# EAGLE design aircom (EAGLE 6.2)
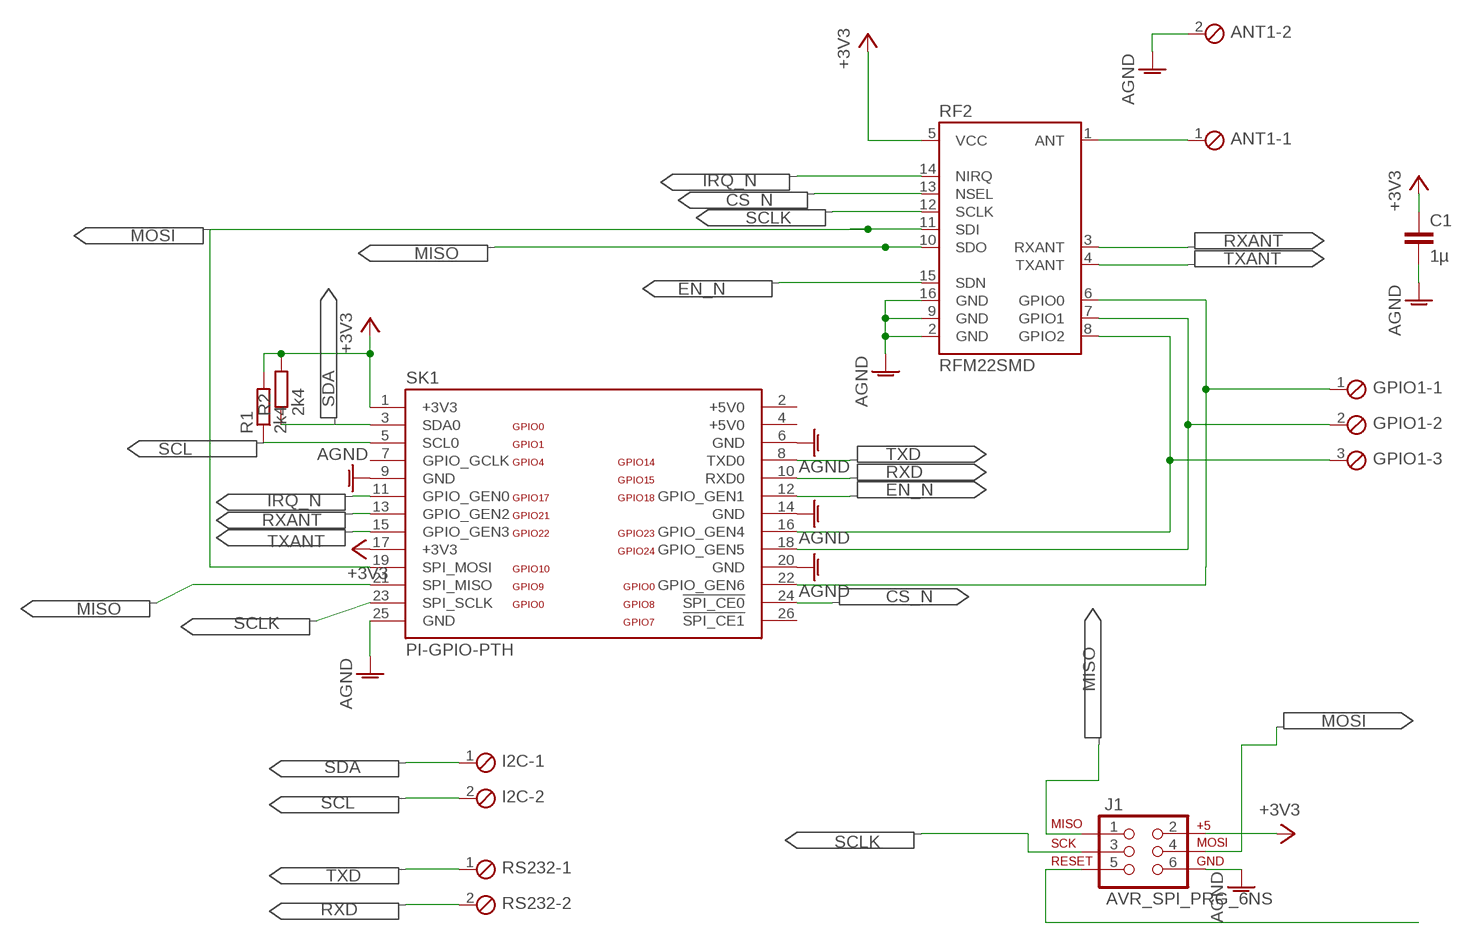
[diagram p0: schematic, sheet 1]

## Parts
ANT1  MPT2  [2POL254]
C1  1µ  C-EUC0805  [C0805]
GPIO1  MPT3  [3POL254]
I2C  MPT2  [2POL254]
J1  AVR_SPI_PRG_6NS  [2X3-NS]
R1  2k4  R-EU_R0603  [R0603]
R2  2k4  R-EU_R0603  [R0603]
RF2  RFM22SMD  [RFM22-XXX-S2]
RS232  MPT2  [2POL254]
SK1  PI-GPIO-PTH  [GPIO-CONNECTOR]

## Nets
+3V3: C1.1 J1.2 R1.2 R2.2 RF2.5(VCC) SK1.1(+3V3) SK1.17(+3V3)
AGND: ANT1.2 C1.2 J1.6 RF2.2(GND) RF2.9(GND) RF2.16(GND) SK1.6(GND) SK1.9(GND) SK1.14(GND) SK1.20(GND) SK1.25(GND)
ANT: ANT1.1 RF2.1(ANT)
CS_N: RF2.13(NSEL) SK1.24(!SPI_CE0)
EN_N: RF2.15(SDN) SK1.12(GPIO_GEN1)
GPIO0: GPIO1.1 RF2.6(GPIO0) SK1.22(GPIO_GEN6)
GPIO1: GPIO1.2 RF2.7(GPIO1) SK1.18(GPIO_GEN5)
GPIO2: GPIO1.3 RF2.8(GPIO2) SK1.16(GPIO_GEN4)
IRQ_N: RF2.14(NIRQ) SK1.11(GPIO_GEN0)
MISO: J1.1 RF2.10(SDO) SK1.21(SPI_MISO)
MOSI: J1.4 RF2.11(SDI) SK1.19(SPI_MOSI)
RESET1: J1.5
RXANT: RF2.3(RXANT) SK1.13(GPIO_GEN2)
RXD: RS232.2 SK1.10(RXD0)
SCL: I2C.2 R1.1 SK1.5(SCL0)
SCLK: J1.3 RF2.12(SCLK) SK1.23(SPI_SCLK)
SDA: I2C.1 R2.1 SK1.3(SDA0)
TXANT: RF2.4(TXANT) SK1.15(GPIO_GEN3)
TXD: RS232.1 SK1.8(TXD0)
Unconnected: SK1.7(GPIO_GCLK) SK1.26(!SPI_CE1)

## Power pins joined to a net without a drawn wire
+5V0: SK1.2(+5V0) SK1.4(+5V0)

## Library data of the parts
ANT1 I2C RS232 = con-phoenix-254:MPT2: PHOENIX CONNECTOR; OC_FARNELL: unknown; OC_NEWARK: unknown
C1 = rcl:C-EU: CAPACITOR, European symbol
GPIO1 = con-phoenix-254:MPT3: PHOENIX CONNECTOR; OC_FARNELL: unknown; OC_NEWARK: unknown
J1 = SparkFun:AVR_SPI_PRG_6: AVR ISP 6 Pin This is the reduced ISP connector for AVR programming. Common on Arduino. This footprint will take up less PCB space and can be used with a 10-pin to 6-pin adapter such as SKU: BOB-08508
R1 R2 = rcl:R-EU_: RESISTOR, European symbol
RF2 = SparkFun:RFM22: Description: The RFM22 is a low-power, low cost radio that is capable of operating in the 434MHz and 900MHz open bands. It's frequency is software defined and there are some very good libraries written for it.
SK1 = jt-raspberry-pi:PI-: Raspberry Pi

## Board
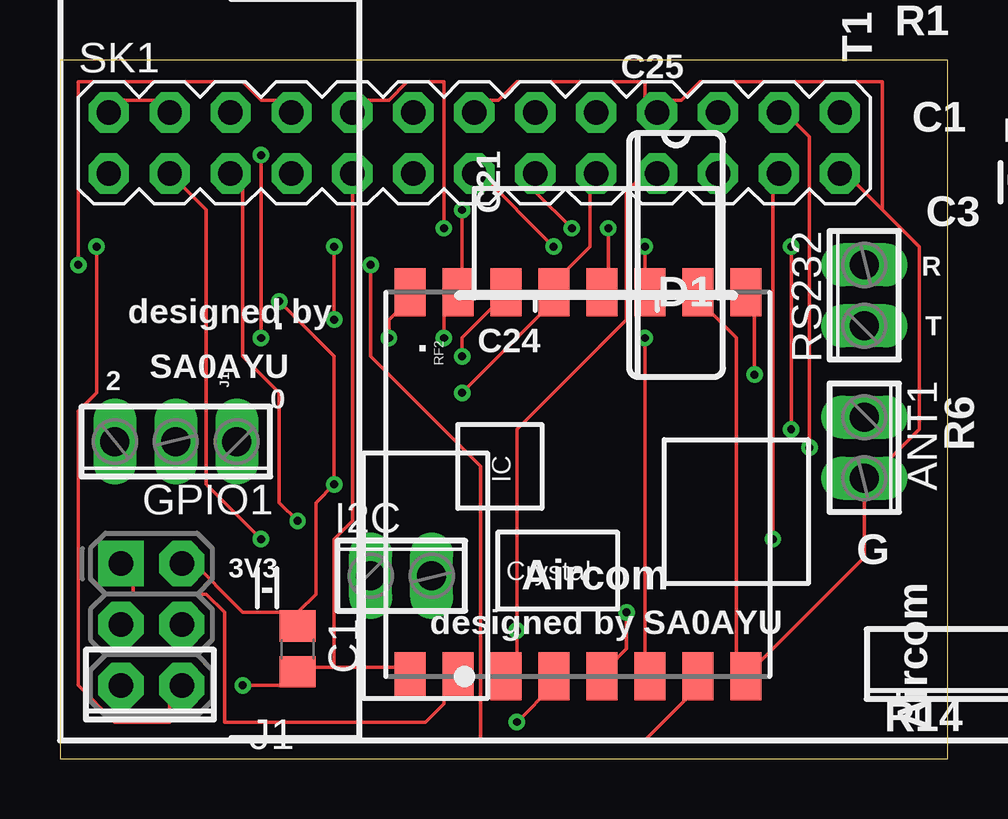
[diagram p1: board, top side]
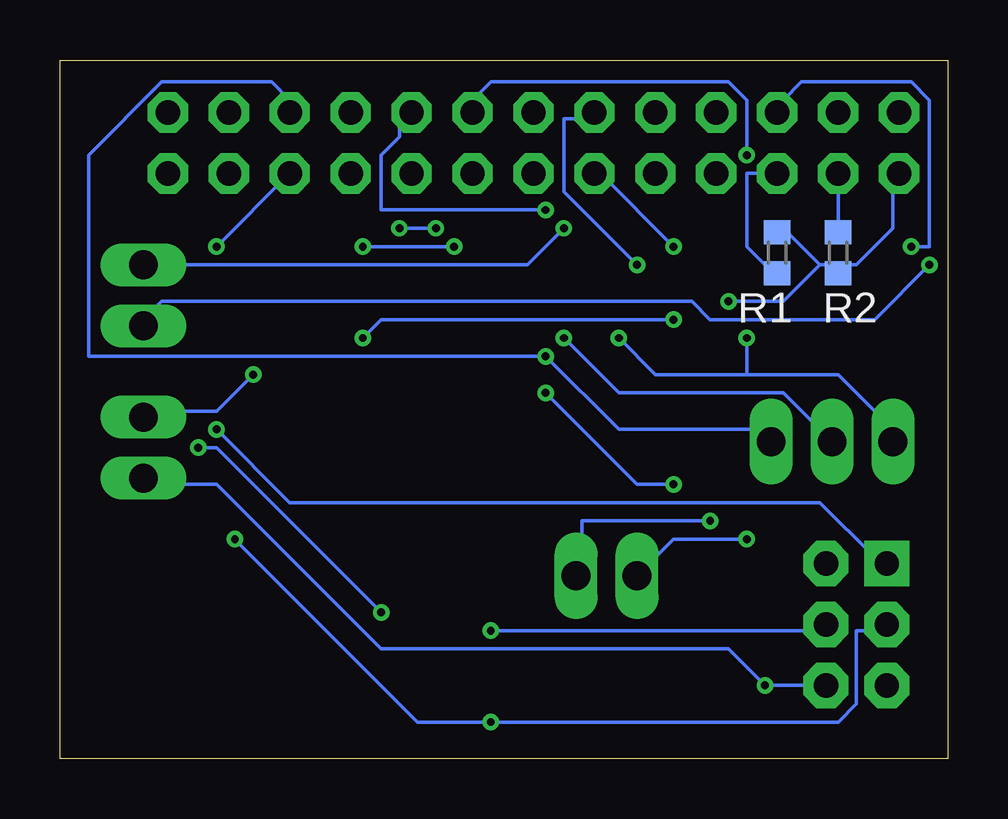
[diagram p2: board, bottom side, seen from below]

Size 37.01 x 29.11 mm. Coordinates in mm from the lower left corner, seen from the top.
Outline: 0,0 37.01,0 37.01,29.11 0,29.11 0,0
Copper layers (1*16): Top 0.0356mm / dielectric 1.5011mm / Bottom 0.0356mm
Design rules: minimum track width 6mil, minimum drill 13mil, track to track 6mil, track to pad 6mil, pad to pad 6mil, via to via 6mil, smd to smd 6mil, copper to edge 15mil, drill to drill 6mil, minimum pad ring 7mil, minimum via ring 7mil, stop-mask expansion 4mil, vias tented up to drill 0mil, thermal gap 10mil

### Footprints (pad centres in the part's own frame; a part is rotated, then mirrored left to right if it is on the bottom)
2POL254 = drill 1.2 long: 1 -1.27,0; 2 1.27,0
C0805 = smd 1.3 x 1.5: 1 -0.95,0; 2 0.95,0
3POL254 = drill 1.2 long: 1 -2.54,0; 2 0,0; 3 2.54,0
2X3-NS = drill 1.016 pad 1.88 square: 1 -2.54,-1.27 | drill 1.016 pad 1.88 octagon: 2 -2.54,1.27; 3 0,-1.27; 4 0,1.27; 5 2.54,-1.27; 6 2.54,1.27
R0603 = smd 1 x 1.1: 1 -0.85,0; 2 0.85,0
RFM22-XXX-S2 = smd 2 x 1.3: 1 -8,7; 2 -8,5; 3 -8,3; 4 -8,1; 5 -8,-1; 6 -8,-3; 7 -8,-5; 8 -8,-7; 9 8,-7; 10 8,-5; 11 8,-3; 12 8,-1; 13 8,1; 14 8,3; 15 8,5; 16 8,7
GPIO-CONNECTOR = drill 1.016 pad 1.676 octagon: 1 -15.24,-1.27; 2 -15.24,1.27; 3 -12.7,-1.27; 4 -12.7,1.27; 5 -10.16,-1.27; 6 -10.16,1.27; 7 -7.62,-1.27; 8 -7.62,1.27; 9 -5.08,-1.27; 10 -5.08,1.27; 11 -2.54,-1.27; 12 -2.54,1.27; 13 0,-1.27; 14 0,1.27; 15 2.54,-1.27; 16 2.54,1.27; 17 5.08,-1.27; 18 5.08,1.27; 19 7.62,-1.27; 20 7.62,1.27; 21 10.16,-1.27; 22 10.16,1.27; 23 12.7,-1.27; 24 12.7,1.27; 25 15.24,-1.27; 26 15.24,1.27

### Placement (x,y rotation side)
ANT1  33.53,12.95 270 top
C1  9.91,4.57 270 top
GPIO1  4.83,13.21 180 top
I2C  14.22,7.62 0 top
J1  3.81,5.59 270 top
R1  7.11,21.08 90 bottom
R2  4.57,21.08 270 bottom
RF2  21.59,11.43 270 top
RS232  33.53,19.3 90 top
SK1  17.27,25.65 0 top

### Tracks (layer width: path | path; a pad name or v marks a point on that pad's centre or on a via)
+3V3  (via drill 0.33)
  Top 0.152: SK1.17 22.1,24.38 22.1,21.34 20.57,19.81 RF2.5 20.57,19.05 v16.76,15.24 | SK1.17 22.86,24.38 SK1.17 | 9.91,6.1 7.62,6.1 5.33,8.38 J1.2 | 9.91,6.1 C1.1 9.91,6.1 | 9.91,6.1 10.67,6.86 10.67,10.67 v11.43,11.43 11.43,16.76 v9.14,19.05 | 2.29,24.38 SK1.1 2.29,24.38
  Bottom 0.152: 5.33,20.57 4.57,20.57 | 5.33,20.57 6.86,22.1 R1.2 | 4.57,20.57 R2.2 4.57,20.57 | 4.57,20.57 3.81,20.57 2.29,22.1 2.29,24.38 SK1.1 | v16.76,15.24 12.95,11.43 v11.43,11.43 | 5.33,20.57 6.86,19.05 v9.14,19.05
+5V0
  Top 0.152: SK1.2 2.29,27.43 4.57,27.43 SK1.4
AGND  (via drill 0.33)
  Top 0.152: 11.43,3.81 14.48,3.81 RF2.9 | 11.43,3.81 9.91,3.81 C1.2 9.91,3.05 v7.62,3.05 | SK1.9 12.19,9.91 11.43,9.14 11.43,3.81 | v1.52,21.34 1.52,15.24 0.76,14.48 0.76,3.05 2.29,1.52 4.57,1.52 4.57,3.05 J1.6 | SK1.14 17.53,27.43 18.29,27.43 19.05,28.19 24.38,28.19 24.38,27.43 SK1.20 25.15,27.43 25.91,27.43 26.67,28.19 34.29,28.19 34.29,22.86 | 33.53,11.43 33.53,8.38 28.96,3.81 RF2.16 28.19,3.81 28.19,17.53 26.67,19.05 RF2.2 | 33.53,11.43 ANT1.2 33.53,11.43 | 34.29,22.86 35.81,21.34 35.81,13.72 33.53,11.43 | 34.29,22.86 32.77,24.38 SK1.25
  Bottom 0.152: v1.52,21.34 0.76,21.34 0.76,27.43 1.52,28.19 6.1,28.19 6.86,27.43 SK1.6 | J1.6 5.33,3.05 v7.62,3.05 9.14,4.57 23.62,4.57 30.48,11.43 33.53,11.43 ANT1.2
ANT  (via drill 0.33)
  Top 0.152: v28.96,16 28.96,19.05 RF2.1
  Bottom 0.152: v28.96,16 30.48,14.48 33.53,14.48 ANT1.1
CS_N  (via drill 0.33)
  Top 0.152: v23.62,6.1 23.62,4.57 22.86,3.81 RF2.13 | v31.24,12.95 31.24,25.91 30.48,26.67 SK1.24
  Bottom 0.152: v23.62,6.1 30.48,12.95 v31.24,12.95
EN_N  (via drill 0.33)
  Top 0.152: v12.95,20.57 12.95,16.76 17.53,12.19 17.53,0.76 24.38,0.76 26.67,3.05 RF2.15
  Bottom 0.152: v12.95,20.57 16,23.62 16,26.67 15.24,26.67 SK1.12
GPIO0  (via drill 0.33)
  Top 0.152: v16.76,16.76 16.76,17.53 18.29,19.05 RF2.6
  Bottom 0.152: GPIO1.1 7.62,13.72 13.72,13.72 v16.76,16.76 35.81,16.76 35.81,25.15 32.77,28.19 28.19,28.19 27.43,27.43 SK1.22
GPIO1  (via drill 0.33)
  Top 0.152: v16,17.53 16,19.05 RF2.7 16.76,19.81 v16.76,22.86
  Bottom 0.152: v16,17.53 13.72,15.24 6.86,15.24 5.33,13.72 GPIO1.2 | v16.76,22.86 23.62,22.86 23.62,25.15 22.86,25.91 22.86,26.67 SK1.18
GPIO2  (via drill 0.33)
  Top 0.152: v13.72,17.53 13.72,18.29 14.48,19.05 RF2.8 | v8.38,17.53 v8.38,25.15
  Bottom 0.152: v13.72,17.53 12.19,16 8.38,16 | 8.38,16 4.57,16 2.29,13.72 GPIO1.3 | v8.38,25.15 8.38,27.43 9.14,28.19 19.05,28.19 19.81,27.43 SK1.16 | 8.38,16 v8.38,17.53
IRQ_N  (via drill 0.33)
  Top 0.152: v24.38,17.53 24.38,3.81 RF2.14 | v11.43,21.34 v11.43,18.29
  Bottom 0.152: v24.38,17.53 23.62,18.29 v11.43,18.29 | v11.43,21.34 14.48,24.38 SK1.11
MISO  (via drill 0.33)
  Top 0.152: RF2.10 16,3.05 16,2.29 15.24,1.52 6.86,1.52 6.86,6.1 6.1,6.86 3.05,6.86 3.05,7.62 J1.1 | v30.48,13.72 v30.48,21.34
  Bottom 0.152: v30.48,21.34 SK1.21 | v30.48,13.72 27.43,10.67 5.33,10.67 3.05,8.38 J1.1
MOSI  (via drill 0.33)
  Top 0.152: RF2.11 19.05,3.81 v19.05,5.33 19.05,13.72 23.62,18.29 23.62,23.62 24.38,24.38 SK1.19
  Bottom 0.152: v19.05,5.33 5.33,5.33 J1.4
RXANT  (via drill 0.33)
  Top 0.152: v24.38,21.34 24.38,19.81 RF2.3 | v20.57,21.34 17.53,24.38 SK1.13
  Bottom 0.152: v20.57,21.34 v24.38,21.34
RXD  (via drill 0.33)
  Top 0.152: v16,22.1 16,28.19 14.48,28.19 13.72,27.43 12.19,27.43 SK1.10
  Bottom 0.152: v16,22.1 17.53,20.57 RS232.2
SCL  (via drill 0.33)
  Top 0.152: v9.91,9.91 9.14,10.67 9.14,15.24 7.62,16.76 7.62,24.38 SK1.5
  Bottom 0.152: R1.1 7.62,20.57 8.38,21.34 8.38,24.38 7.62,24.38 SK1.5 | v9.91,9.91 15.24,9.91 15.24,7.62 I2C.2
SCLK  (via drill 0.33)
  Top 0.152: v19.05,1.52 20.57,3.05 RF2.12 | v29.72,9.14 29.72,24.38 SK1.23
  Bottom 0.152: J1.3 3.05,5.33 3.81,5.33 3.81,2.29 4.57,1.52 v19.05,1.52 22.1,1.52 v29.72,9.14
SDA  (via drill 0.33)
  Top 0.152: v8.38,9.14 6.1,11.43 6.1,22.86 SK1.3
  Bottom 0.152: SK1.3 4.57,22.1 R2.1 | I2C.1 11.43,9.14 v8.38,9.14
TXANT  (via drill 0.33)
  Top 0.152: v22.86,22.1 22.86,19.81 RF2.4 | v21.34,22.1 19.81,23.62 SK1.15
  Bottom 0.152: v21.34,22.1 v22.86,22.1
TXD  (via drill 0.33)
  Top 0.152: v0.76,20.57 0.76,28.19 7.62,28.19 8.38,27.43 9.14,27.43 SK1.8
  Bottom 0.152: v0.76,20.57 3.05,18.29 9.91,18.29 10.67,19.05 32.77,19.05 33.53,18.29 RS232.1

### Text on the board
tNames: R | designed by | T | SA0AYU | 2 | 0 | G | 3V3 | Aircom | G
_tplace: T1 | C25 | R1 | L2 | ANT | C21 | C1 | L1 | L3 | C5 | C3 | TR1001 | D1 | C24 | R12 | J1 | IC | R11 | Crystal | R6 | R7 | Aircom | designed by SA0AYU | C6 | R14 | J3
_bplace: C23 | C22 | C2 | C10 | R2 | C4 | R13 | U1 | R10 | R4 | R3 | R15